# EAGLE schematic usb_cdcacm (EAGLE 8.3.0)
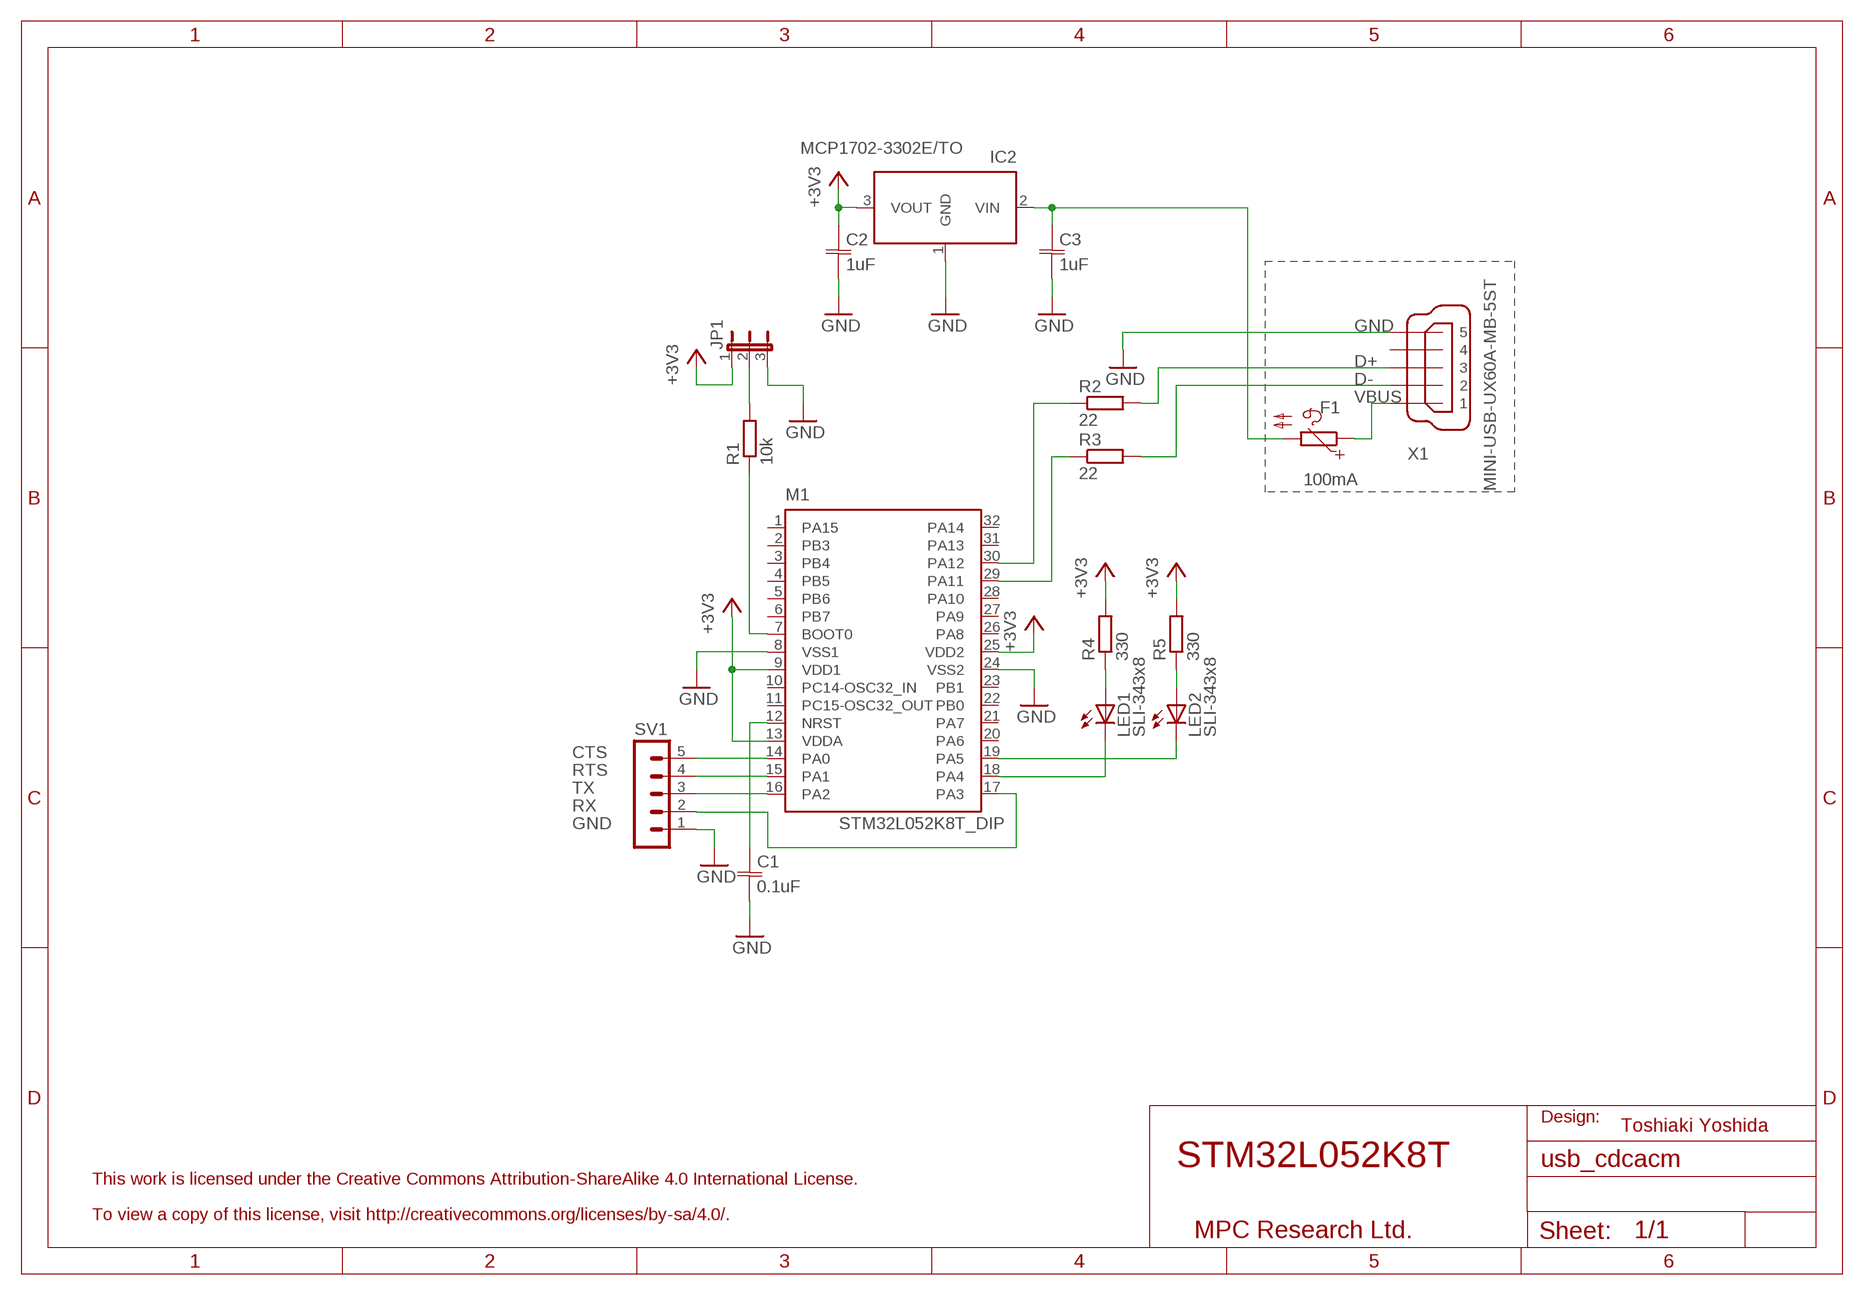
[diagram p0: schematic, sheet 1]

## Parts
C1  0.1uF  C-JIS050-024X044  [C050-024X044]
C2  1uF  C-JIS050-024X044  [C050-024X044]
C3  1uF  C-JIS050-024X044  [C050-024X044]
F1  100mA  PTC1206  [1206]
IC2  MCP1702-3302E/TO  [TO92]
JP1  JP2E  [JP2]
LED1  SLI-343x8  LED3MM  [LED3MM]
LED2  SLI-343x8  LED3MM  [LED3MM]
M1  STM32L052K8T_DIP  [DIP32]
R1  10k  R-EU_0207/2V  [0207/2V]
R2  22  R-EU_0207/10  [0207/10]
R3  22  R-EU_0207/10  [0207/10]
R4  330  R-EU_0207/2V  [0207/2V]
R5  330  R-EU_0207/2V  [0207/2V]
SV1  MA05-1  [MA05-1]
X1  MINI-USB-UX60A-MB-5ST  [UX60A-MB-5ST]

## Nets
+3V3: C2.1 IC2.3(VOUT) JP1.1 M1.9(VDD1) M1.13(VDDA) M1.25(VDD2) R4.2 R5.2
GND: C1.2 C2.2 C3.2 IC2.1(GND) JP1.3 M1.8(VSS1) M1.24(VSS2) SV1.1 X1.5
N$1: M1.14(PA0) SV1.5
N$2: M1.7(BOOT0) R1.1
N$3: M1.15(PA1) SV1.4
N$4: C1.1 M1.12(NRST)
N$5: M1.16(PA2) SV1.3
N$6: JP1.2 R1.2
N$7: LED2.A R5.1
N$8: M1.17(PA3) SV1.2
N$9: LED1.A R4.1
N$10: M1.29(PA11) R3.1
N$11: R3.2 X1.2
N$12: M1.30(PA12) R2.1
N$13: R2.2 X1.3
N$14: F1.1 X1.1
N$15: C3.1 F1.2 IC2.2(VIN)
N$16: LED1.K(C) M1.18(PA4)
N$17: LED2.K(C) M1.19(PA5)
Unconnected: M1.1(PA15) M1.2(PB3) M1.3(PB4) M1.4(PB5) M1.5(PB6) M1.6(PB7) M1.10(PC14-OSC32_IN) M1.11(PC15-OSC32_OUT) M1.20(PA6) M1.21(PA7) M1.22(PB0) M1.23(PB1) M1.26(PA8) M1.27(PA9) M1.28(PA10) M1.31(PA13) M1.32(PA14) X1.4

## Notes on the sheet
- GND
- D+
- D-
- VBUS
- CTS
- RTS
- TX
- RX
- GND
- Design:
- Toshiaki Yoshida
- STM32L052K8T
- This work is licensed under the Creative Commons Attribution-ShareAlike 4.0 International License.
- To view a copy of this license, visit http://creativecommons.org/licenses/by-sa/4.0/.
- MPC Research Ltd.

## Library data of the parts
C1-C3 = cap:C-JIS: CAPACITOR, Japanese symbol
F1 = polyswitch:PTC: PolySwitch Resettable Device Polymeric Positive Temperature Coefficient device
IC2 = v-reg:MCP1702: MCP1702 250mA Low Quiescent Current LDO Regulator; VOLTAGE: 3.3V
JP1 = jumper:JP2E: JUMPER
LED1 LED2 = led:LED: LED OSRAM: - CHIPLED LG R971, LG N971, LY N971, LG Q971, LY Q971, LO R971, LY R971 LH N974, LH R974 LS Q976, LO Q976, LY Q976 LO Q996 - Hyper CHIPLED LW Q18S LB Q993, LB Q99A, LB R99A - SideLED LS A670, LO A670, LY A670, LG A670, LP A670 LB A673, LV A673, LT A673, LW A673 LH A674 LY A675 LS A676, LA A676, LO A676, LY A676, LW A676 LS A679, LY A679, LG A679 - Hyper Micro SIDELED® LS Y876, LA Y876, LO Y876, LY Y876 LT Y87S - SmartLED LW L88C, LW L88S LB L89C, LB L89S, LG L890 LS L89K, LO L89K, LY L89K LS L896, LA L896, LO L896, LY L896 - TOPLED LS T670, LO T670, LY T670, LG T670, LP T670 LSG T670, LSP T670, LSY T670, LOP T670, LYG T670 LG T671, LOG T671, LSG T671 LB T673, LV T673, LT T673, LW T673 LH T674 LS T676, LA T676, LO T676, LY T676, LB T676, LH T676, LSB T676, LW T676 LB T67C, LV T67C, LT T67C, LS T67K, LO T67K, LY T67K, LW E67C LS E67B, LA E67B, LO E67B, LY E67B, LB E67C, LV E67C, LT E67C LW T67C LS T679, LY T679, LG T679 LS T770, LO T770, LY T770, LG T770, LP T770 LB T773, LV T773, LT T773, LW T773 LH T774 LS E675, LA E675, LY E675, LS T675 LS T776, LA T776, LO T776, LY T776, LB T776 LHGB T686 LT T68C, LB T68C - Hyper Mini TOPLED® LB M676 - Mini TOPLED Santana® LG M470 LS M47K, LO M47K, LY M47K Source: http://www.osram.convergy.de LUXEON: - LUMILED® LXK2-PW12-R00, LXK2-PW12-S00, LXK2-PW14-U00, LXK2-PW14-V00 LXK2-PM12-R00, LXK2-PM12-S00, LXK2-PM14-U00 LXK2-PE12-Q00, LXK2-PE12-R00, LXK2-PE12-S00, LXK2-PE14-T00, LXK2-PE14-U00 LXK2-PB12-K00, LXK2-PB12-L00, LXK2-PB12-M00, LXK2-PB14-N00, LXK2-PB14-P00, LXK2-PB14-Q00 LXK2-PR12-L00, LXK2-PR12-M00, LXK2-PR14-Q00, LXK2-PR14-R00 LXK2-PD12-Q00, LXK2-PD12-R00, LXK2-PD12-S00 LXK2-PH12-R00, LXK2-PH12-S00 LXK2-PL12-P00, LXK2-PL12-Q00, LXK2-PL12-R00 Source: www.luxeon.com KINGBRIGHT: KA-3528ASYC Source: www.kingbright.com
M1 = stm32:STM32L052K8T_DIP
R1-R5 = resistor:R-EU_: RESISTOR, European symbol
SV1 = con-lstb:MA05-1: PIN HEADER; OC_FARNELL: unknown; OC_NEWARK: unknown
X1 = con-hirose:MINI-USB-: MINI USB Connector Source: http://www.hirose.co.jp/cataloge_hp/e24000019.pdf; OC_FARNELL: unknown; OC_NEWARK: unknown